# Altium schematic sheet controller.SchDoc
size A
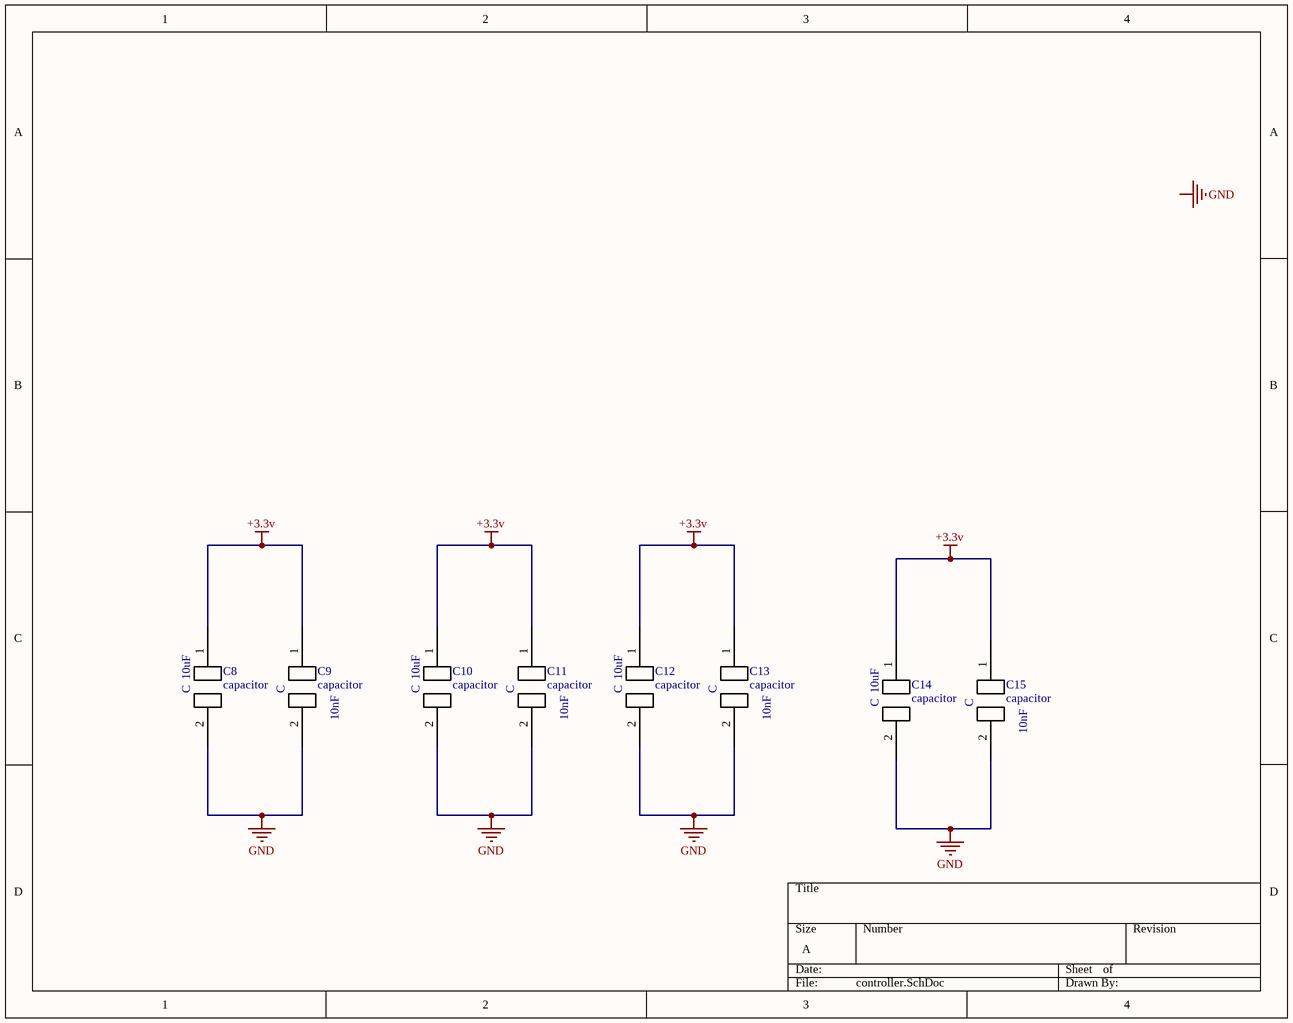
[diagram p0: controller.SchDoc]

## Parts
C8  capacitor  [0603]
C9  capacitor  [0603]
C10  capacitor  [0603]
C11  capacitor  [0603]
C12  capacitor  [0603]
C13  capacitor  [0603]
C14  capacitor  [0603]
C15  capacitor  [0603]

## Nets
+3.3v: C8.1 C9.1 C10.1 C11.1 C12.1 C13.1 C14.1 C15.1
GND: C8.2 C9.2 C10.2 C11.2 C12.2 C13.2 C14.2 C15.2

## Notes on the sheet
- Labels drawn without touching a wire or pin: GND
- (in symbol capacitor) 10uF; C; 10nF